# Altium project PiComputeProject.PrjPcb
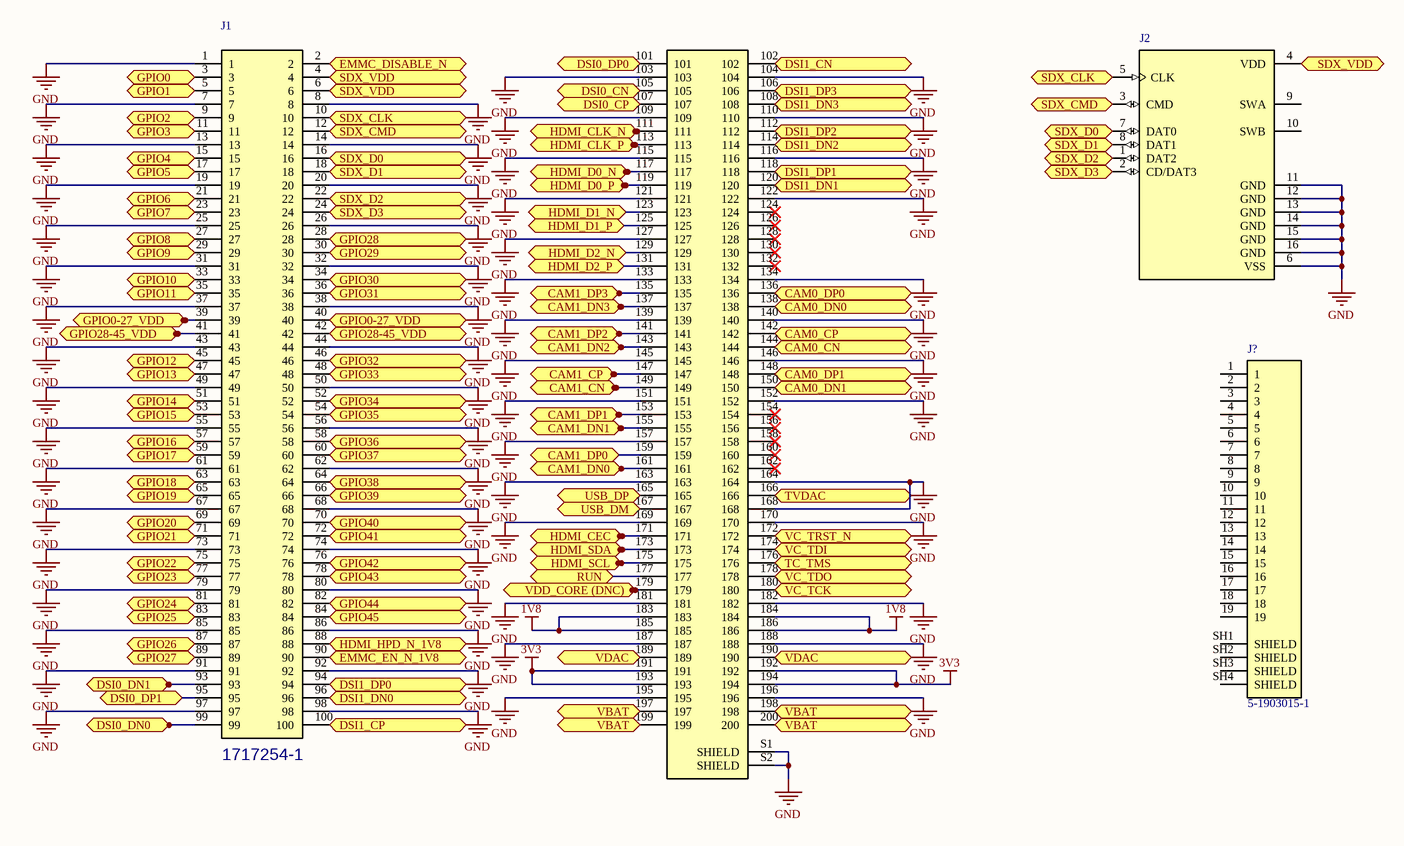
[diagram p0: Connectors.SchDoc]
3 sheets, 27 parts. Net scope: flat (ports and power ports of the same name join across sheets).
Board file: RasPiComputePCB.PcbDoc
Sheets:
  Connectors.SchDoc
  USB_HUB.SchDoc
  AUDIO.SchDoc

## Sheet Connectors.SchDoc: RasPiCompute_Connectors
size B; Engineer: Benjamin Beaudoin; Revision: v0.1

### Parts
(Parts that share a designator on the sheet are numbered #1, #2 ... from top to bottom, then left to right.)
J1  1717254-1  [TE_1717254-1_1717254-1(Primary)]
J2  2201778-1  [TE_2201778-1]  (value not drawn)
J?#1  5-1903015-1  [TE_5-1903015-1_5-1903015-1(Primary)]

### Ports
CAM0_CN, CAM0_CP, CAM0_DN0, CAM0_DN1, CAM0_DP0, CAM0_DP1, CAM1_CN, CAM1_CP, CAM1_DN0, CAM1_DN1, CAM1_DN2, CAM1_DN3, CAM1_DP0, CAM1_DP1, CAM1_DP2, CAM1_DP3, DSI0_CN, DSI0_CP, DSI0_DN0, DSI0_DN1, DSI0_DP0, DSI0_DP1, DSI1_CN, DSI1_CP, DSI1_DN0, DSI1_DN1, DSI1_DN2, DSI1_DN3, DSI1_DP0, DSI1_DP1, DSI1_DP2, DSI1_DP3, EMMC_DISABLE_N, EMMC_EN_N_1V8, GPIO0, GPIO0-27_VDD, GPIO1, GPIO2, GPIO3, GPIO4, GPIO5, GPIO6, GPIO7, GPIO8, GPIO9, GPIO10, GPIO11, GPIO12, GPIO13, GPIO14, GPIO15, GPIO16, GPIO17, GPIO18, GPIO19, GPIO20, GPIO21, GPIO22, GPIO23, GPIO24, GPIO25, GPIO26, GPIO27, GPIO28, GPIO28-45_VDD, GPIO29, GPIO30, GPIO31, GPIO32, GPIO33, GPIO34, GPIO35, GPIO36, GPIO37, GPIO38, GPIO39, GPIO40, GPIO41, GPIO42, GPIO43, GPIO44, GPIO45, HDMI_CEC, HDMI_CLK_N, HDMI_CLK_P, HDMI_D0_N, HDMI_D0_P, HDMI_D1_N, HDMI_D1_P, HDMI_D2_N, HDMI_D2_P, HDMI_HPD_N_1V8, HDMI_SCL, HDMI_SDA, RUN, SDX_CLK, SDX_CMD, SDX_D0, SDX_D1, SDX_D2, SDX_D3, SDX_VDD, TC_TMS, TVDAC, USB_DM, USB_DP, VBAT, VC_TCK, VC_TDI, VC_TDO, VC_TRST_N, VDAC, VDD_CORE (DNC)

### Nets
1V8: J1.183 J1.184 J1.185 J1.186
3V3: J1.191 J1.192 J1.193 J1.194
GND: J1.1 J1.7 J1.8 J1.13 J1.14 J1.19 J1.20 J1.25 J1.26 J1.31 J1.32 J1.37 J1.38 J1.43 J1.44 J1.49 J1.50 J1.55 J1.56 J1.61 J1.62 J1.67 J1.68 J1.73 J1.74 J1.79 J1.80 J1.85 J1.86 J1.91 J1.92 J1.97 J1.98 J1.103 J1.104 J1.109 J1.110 J1.115 J1.116 J1.121 J1.122 J1.127 J1.133 J1.134 J1.139 J1.140 J1.145 J1.146 J1.151 J1.152 J1.157 J1.163 J1.164 J1.168 J1.169 J1.170 J1.181 J1.182 J1.187 J1.188 J1.195 J1.196 J1.S1(SHIELD) J1.S2(SHIELD) J2.6(VSS) J2.11(GND) J2.12(GND) J2.13(GND) J2.14(GND) J2.15(GND) J2.16(GND)
US0_USB0_N: J1.167 ; port USB_DM
US0_USB0_P: J1.165 ; port USB_DP
NetJ1_2: J1.2 ; port EMMC_DISABLE_N
NetJ1_3: J1.3 ; port GPIO0
NetJ1_4: J1.4 J1.6 J2.4(VDD) ; port SDX_VDD
NetJ1_5: J1.5 ; port GPIO1
NetJ1_9: J1.9 ; port GPIO2
NetJ1_10: J1.10 J2.5(CLK) ; port SDX_CLK
NetJ1_11: J1.11 ; port GPIO3
NetJ1_12: J1.12 J2.3(CMD) ; port SDX_CMD
NetJ1_15: J1.15 ; port GPIO4
NetJ1_16: J1.16 J2.7(DAT0) ; port SDX_D0
NetJ1_17: J1.17 ; port GPIO5
NetJ1_18: J1.18 J2.8(DAT1) ; port SDX_D1
NetJ1_21: J1.21 ; port GPIO6
NetJ1_22: J1.22 J2.1(DAT2) ; port SDX_D2
NetJ1_23: J1.23 ; port GPIO7
NetJ1_24: J1.24 J2.2(CD/DAT3) ; port SDX_D3
NetJ1_27: J1.27 ; port GPIO8
NetJ1_28: J1.28 ; port GPIO28
NetJ1_29: J1.29 ; port GPIO9
NetJ1_30: J1.30 ; port GPIO29
NetJ1_33: J1.33 ; port GPIO10
NetJ1_34: J1.34 ; port GPIO30
NetJ1_35: J1.35 ; port GPIO11
NetJ1_36: J1.36 ; port GPIO31
NetJ1_39: J1.39 J1.40 ; port GPIO0-27_VDD
NetJ1_41: J1.41 J1.42 ; port GPIO28-45_VDD
NetJ1_45: J1.45 ; port GPIO12
NetJ1_46: J1.46 ; port GPIO32
NetJ1_47: J1.47 ; port GPIO13
NetJ1_48: J1.48 ; port GPIO33
NetJ1_51: J1.51 ; port GPIO14
NetJ1_52: J1.52 ; port GPIO34
NetJ1_53: J1.53 ; port GPIO15
NetJ1_54: J1.54 ; port GPIO35
NetJ1_57: J1.57 ; port GPIO16
NetJ1_58: J1.58 ; port GPIO36
NetJ1_59: J1.59 ; port GPIO17
NetJ1_60: J1.60 ; port GPIO37
NetJ1_63: J1.63 ; port GPIO18
NetJ1_64: J1.64 ; port GPIO38
NetJ1_65: J1.65 ; port GPIO19
NetJ1_66: J1.66 ; port GPIO39
NetJ1_69: J1.69 ; port GPIO20
NetJ1_70: J1.70 ; port GPIO40
NetJ1_71: J1.71 ; port GPIO21
NetJ1_72: J1.72 ; port GPIO41
NetJ1_75: J1.75 ; port GPIO22
NetJ1_76: J1.76 ; port GPIO42
NetJ1_77: J1.77 ; port GPIO23
NetJ1_78: J1.78 ; port GPIO43
NetJ1_81: J1.81 ; port GPIO24
NetJ1_82: J1.82 ; port GPIO44
NetJ1_83: J1.83 ; port GPIO25
NetJ1_84: J1.84 ; port GPIO45
NetJ1_87: J1.87 ; port GPIO26
NetJ1_88: J1.88 ; port HDMI_HPD_N_1V8
NetJ1_89: J1.89 ; port GPIO27
NetJ1_90: J1.90 ; port EMMC_EN_N_1V8
NetJ1_93: J1.93 ; port DSI0_DN1
NetJ1_94: J1.94 ; port DSI1_DP0
NetJ1_95: J1.95 ; port DSI0_DP1
NetJ1_96: J1.96 ; port DSI1_DN0
NetJ1_99: J1.99 ; port DSI0_DN0
NetJ1_100: J1.100 ; port DSI1_CP
NetJ1_101: J1.101 ; port DSI0_DP0
NetJ1_102: J1.102 ; port DSI1_CN
NetJ1_105: J1.105 ; port DSI0_CN
NetJ1_106: J1.106 ; port DSI1_DP3
NetJ1_107: J1.107 ; port DSI0_CP
NetJ1_108: J1.108 ; port DSI1_DN3
NetJ1_111: J1.111 ; port HDMI_CLK_N
NetJ1_112: J1.112 ; port DSI1_DP2
NetJ1_113: J1.113 ; port HDMI_CLK_P
NetJ1_114: J1.114 ; port DSI1_DN2
NetJ1_117: J1.117 ; port HDMI_D0_N
NetJ1_118: J1.118 ; port DSI1_DP1
NetJ1_119: J1.119 ; port HDMI_D0_P
NetJ1_120: J1.120 ; port DSI1_DN1
NetJ1_123: J1.123 ; port HDMI_D1_N
NetJ1_125: J1.125 ; port HDMI_D1_P
NetJ1_129: J1.129 ; port HDMI_D2_N
NetJ1_131: J1.131 ; port HDMI_D2_P
NetJ1_135: J1.135 ; port CAM1_DP3
NetJ1_136: J1.136 ; port CAM0_DP0
NetJ1_137: J1.137 ; port CAM1_DN3
NetJ1_138: J1.138 ; port CAM0_DN0
NetJ1_141: J1.141 ; port CAM1_DP2
NetJ1_142: J1.142 ; port CAM0_CP
NetJ1_143: J1.143 ; port CAM1_DN2
NetJ1_144: J1.144 ; port CAM0_CN
NetJ1_147: J1.147 ; port CAM1_CP
NetJ1_148: J1.148 ; port CAM0_DP1
NetJ1_149: J1.149 ; port CAM1_CN
NetJ1_150: J1.150 ; port CAM0_DN1
NetJ1_153: J1.153 ; port CAM1_DP1
NetJ1_155: J1.155 ; port CAM1_DN1
NetJ1_159: J1.159 ; port CAM1_DP0
NetJ1_161: J1.161 ; port CAM1_DN0
NetJ1_166: J1.166 ; port TVDAC
NetJ1_171: J1.171 ; port HDMI_CEC
NetJ1_172: J1.172 ; port VC_TRST_N
NetJ1_173: J1.173 ; port HDMI_SDA
NetJ1_174: J1.174 ; port VC_TDI
NetJ1_175: J1.175 ; port HDMI_SCL
NetJ1_176: J1.176 ; port TC_TMS
NetJ1_177: J1.177 ; port RUN
NetJ1_178: J1.178 ; port VC_TDO
NetJ1_179: J1.179 ; port VDD_CORE (DNC)
NetJ1_180: J1.180 ; port VC_TCK
NetJ1_189: J1.189 J1.190 ; port VDAC
NetJ1_197: J1.197 J1.198 J1.199 J1.200 ; port VBAT

Not connected (* = marked no-connect by the designer): J1 124* 126* 128* 130* 132* 154* 156* 158* 160* 162*; J2 9(SWA) 10(SWB); J?#1 1 2 3 4 5 6 7 8 9 10 11 12 13 14 15 16 17 18 19 SH1(SHIELD) SH2(SHIELD) SH3(SHIELD) SH4(SHIELD)

### Library data of the parts
J1 = 1717254-1: EMBOSS ASS'Y DDR SODIMM SOCKET; Centerline_Pitch: .6 mm[.024 in]; MF: TE Connectivity; Number_of_Positions: 200; Product_Type: Socket; EU_RoHS_Compliance: Compliant; Digi-Key_Part_Number: A111047CT-ND; Package: None; Digi-Key_Purchase_URL: https://www.digikey.com/product-detail/en/te-connectivity-amp-connectors/1717254-1/A111047CT-ND/4142431?utm_source=snapeda&utm_medium=aggregator&utm_campaign=symbol; SnapEDA_Link: https://www.snapeda.com/parts/1717254-1/TE%20Connectivity%20AMP%20Connectors/view-part/?ref=snap; MP: 1717254-1; Link: http://www.te.com/usa-en/product-1717254-1.html; Value: *
J2 = 2201778-1: MICRO SD PUSH PUSH LOW PROFILE TYPE; Number_of_Positions: 8; Centerline_Pitch: 1.1 mm[.04 in]; MF: TE Connectivity; Product_Type: Removable Memory Products; MP: 2201778-1; Link: http://www.te.com/usa-en/product-2201778-1.html; SnapEDA_Link: https://www.snapeda.com/parts/2201778-1/TE%20Connectivity%20AMP%20Connectors/view-part/?ref=snap; Price: 2.18 USD; EU_RoHS_Compliance: Compliant; Package: None; Availability: Good; Value: *
J?#1 = 5-1903015-1: Conn HDMI RCP 19 POS 0.5mm Solder RA SMD 19 Terminal 1 Port Embossed T/R; MF: TE Connectivity; Availability: Good; EU_RoHS_Compliance: Compliant; Price: 1.43 USD; Package: None; SnapEDA_Link: https://www.snapeda.com/parts/5-1903015-1/TE%20Connectivity%20AMP%20Connectors/view-part/?ref=snap; MP: 5-1903015-1; Link: http://www.te.com/usa-en/product-5-1903015-1.html; Value: *

## Sheet USB_HUB.SchDoc: RasPiCompute_USB_HUB
size B; Engineer: Benjamin Beaudoin; Revision: v0.1
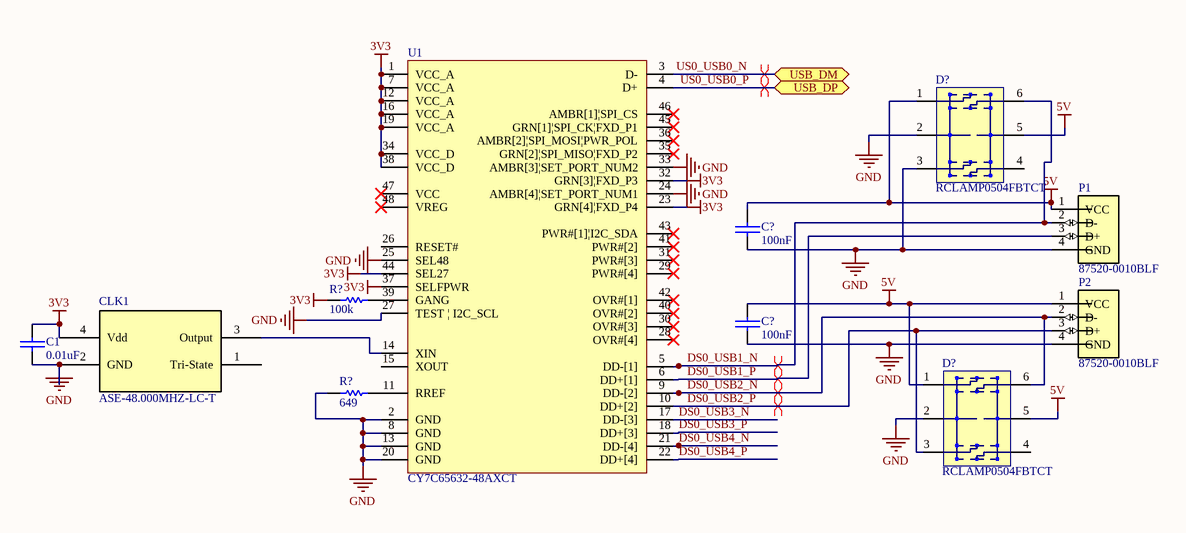
[diagram p1: USB_HUB.SchDoc]

### Parts
(Parts that share a designator on the sheet are numbered #1, #2 ... from top to bottom, then left to right.)
C1  0.01uF  [0402C]
C?#1  100nF  [0402C]
C?#2  100nF  [0402C]
CLK1  ASE-48.000MHZ-LC-T  [ASE-48.000MHZ-LC-T]
D?#1  RCLAMP0504FBTCT
D?#2  RCLAMP0504FBTCT
P1  87520-0010BLF  [FCI_87520-0010BLF]
P2  87520-0010BLF  [FCI_87520-0010BLF]
R?#1  100k  [0402C]
R?#2  649  [0402C]
U1  CY7C65632-48AXCT  [TQFP-48]

### Ports
USB_DM, USB_DP

### Nets
3V3: C1.1 CLK1.4(Vdd) R?#1.1 U1.1(VCC_A) U1.7(VCC_A) U1.12(VCC_A) U1.16(VCC_A) U1.19(VCC_A) U1.23(GRN[4]|FXD_P4) U1.32(GRN[3]|FXD_P3) U1.34(VCC_D) U1.37(SELFPWR) U1.38(VCC_D) U1.44(SEL27)
5V: C?#1.1 C?#2.1 D?#1.1 D?#1.5 D?#2.1 D?#2.5 P1.1(VCC) P2.1(VCC)
GND: C1.2 C?#1.2 C?#2.2 CLK1.2(GND) D?#1.2 D?#1.3 D?#2.2 P1.4(GND) P2.4(GND) R?#2.1 U1.2(GND) U1.8(GND) U1.13(GND) U1.20(GND) U1.24(AMBR[4]|SET_PORT_NUM1) U1.25(SEL48) U1.27(TEST_|_I2C_SCL) U1.33(AMBR[3]|SET_PORT_NUM2)
DS0_USB1_N: D?#1.6 P1.2(D-) U1.5(DD-[1])
DS0_USB1_P: P1.3(D+) U1.6(DD+[1])
DS0_USB2_N: D?#2.6 P2.2(D-) U1.9(DD-[2])
DS0_USB2_P: D?#2.3 P2.3(D+) U1.10(DD+[2])
DS0_USB3_N: U1.17(DD-[3])
DS0_USB3_P: U1.18(DD+[3])
DS0_USB4_N: U1.21(DD-[4])
DS0_USB4_P: U1.22(DD+[4])
US0_USB0_N: U1.3(D-) ; port USB_DM
US0_USB0_P: U1.4(D+) ; port USB_DP
NetCLK1_3: CLK1.3(Output) U1.14(XIN)
NetR?#1_2: R?#1.2 U1.39(GANG)
NetR?#2_2: R?#2.2 U1.11(RREF)

Not connected (* = marked no-connect by the designer): CLK1 1(Tri-State); D?#1 4(0); D?#2 4(0); U1 15(XOUT) 26(RESET#) 28(OVR#[4])* 29(PWR#[4])* 30(OVR#[3])* 31(PWR#[3])* 35(GRN[2]|SPI_MISO|FXD_P2)* 36(AMBR[2]|SPI_MOSI|PWR_POL)* 40(OVR#[2])* 41(PWR#[2])* 42(OVR#[1])* 43(PWR#[1]|I2C_SDA)* 45(GRN[1]|SPI_CK|FXD_P1)* 46(AMBR[1]|SPI_CS)* 47(VCC)* 48(VREG)*

### Layout directives
differential pair: DS0_USB1_N, DS0_USB1_P, DS0_USB2_N, DS0_USB2_P, US0_USB0_N, US0_USB0_P

### Library data of the parts
C1 C?#1 C?#2 = C: Capacitor; Power_WV_SRF: 25V; MFGPN: *; MFG: *; Tolerance: *; TempCo: *; Distributor: *; CMPN: *
  C1: Value: 0.01uF
  C?#1 C?#2: Value: 100nF
CLK1 = ASE-48.000MHZ-LC-T: OSC XO 48.000MHZ CMOS SMD
D?#1 D?#2 = RCLAMP0504FBTCT: TVS DIODE 5V 17.5V SC70-6
P1 P2 = 87520-0010BLF: 87520 Series Single Port 4 Contact Unshielded Board Lock USB-A Receptacle; MF: Amphenol ICC; Digi-Key_Purchase_URL: https://www.digikey.com/product-detail/en/amphenol-fci/87520-0010BLF/609-1045-ND/1001359?utm_source=snapeda&utm_medium=aggregator&utm_campaign=symbol; Digi-Key_Part_Number: 609-1045-ND; Package: None; SnapEDA_Link: https://www.snapeda.com/parts/87520-0010BLF/Amphenol%20ICC/view-part/?ref=snap; MP: 87520-0010BLF; Value: *
R?#1 = R: Resistor; Tolerance: 5%; Value: 100k; Power_WV_SRF: *; MFG: *; MFGPN: *; Distributor: *; CMPN: *
R?#2 = R: Resistor; Tolerance: 1%; Value: 649; Power_WV_SRF: *; MFG: *; MFGPN: *; Distributor: *; CMPN: *

## Sheet AUDIO.SchDoc: RasPiCompute_AUDIO
size B; Engineer: Benjamin Beaudoin; Revision: v0.1
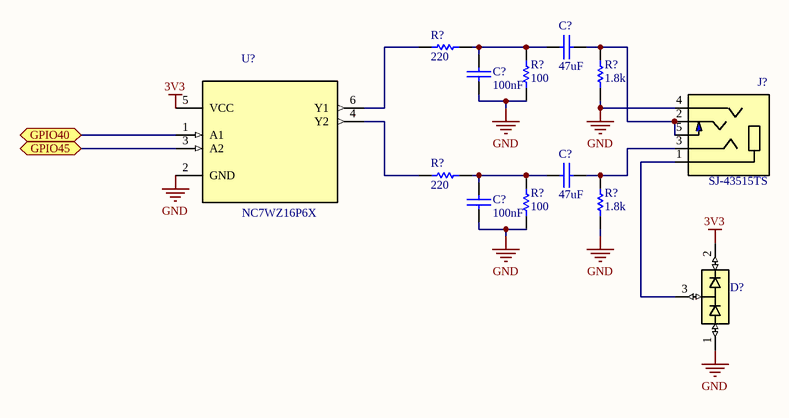
[diagram p2: AUDIO.SchDoc]

### Parts
(Parts that share a designator on the sheet are numbered #1, #2 ... from top to bottom, then left to right.)
C?#3  47uF  [0402C]
C?#4  100nF  [0402C]
C?#5  47uF  [0402C]
C?#6  100nF  [0402C]
D?#3  BAV99  [SOT23-3]  (value not drawn)
J?#2  SJ-43515TS  [CUI_SJ-43515TS]
R?#3  220  [0402C]
R?#4  100  [0402C]
R?#5  1.8k  [0402C]
R?#6  220  [0402C]
R?#7  100  [0402C]
R?#8  1.8k  [0402C]
U?  NC7WZ16P6X  [SOT65P210X110-6N]

### Ports
GPIO40, GPIO45

### Nets
3V3: D?#3.2(C2) U?.5(VCC)
GND: C?#4.1 C?#6.1 D?#3.1(A1) J?#2.4(RING2) R?#4.1 R?#5.1 R?#7.1 R?#8.1 U?.2(GND)
NetC?#3_1: C?#3.1 C?#4.2 R?#3.2 R?#4.2
NetC?#3_2: C?#3.2 J?#2.2(TIP) J?#2.5(TIP_SWITCH) R?#5.2
NetC?#5_1: C?#5.1 C?#6.2 R?#6.2 R?#7.2
NetC?#5_2: C?#5.2 J?#2.3(RING1) R?#8.2
NetD?#3_3: D?#3.3(COM) J?#2.1(SLEEVE)
NetJ1_70: U?.1(A1) ; port GPIO40
NetJ1_84: U?.3(A2) ; port GPIO45
NetR?#3_1: R?#3.1 U?.6(Y1)
NetR?#6_1: R?#6.1 U?.4(Y2)

### Library data of the parts
C?#3-C?#6 = C: Capacitor; Power_WV_SRF: 25V; MFGPN: *; MFG: *; Tolerance: *; TempCo: *; Distributor: *; CMPN: *
  C?#3 C?#5: Value: 47uF
  C?#4 C?#6: Value: 100nF
D?#3 = BAV99: Diode, Small Signal; 250 mA; 1.25 V _Max._; 300 mW; 430 K/W; 70 V; 6 nS _Max._; MF: ON Semiconductor; SnapEDA_Link: https://www.snapeda.com/parts/BAV99/ON%20Semiconductor/view-part/?ref=snap; Package: SOT-23-3 Vishay; Price: 0.07 USD; Availability: Unavailable; MP: BAV99; Value: *
J?#2 = SJ-43515TS: 4 Conductor PCB Mount Low Profile 3.5 mm Audio Jack; MF: CUI; MP: SJ-43515TS; Package: None; Availability: Good; SnapEDA_Link: https://www.snapeda.com/parts/SJ-43515TS/CUI/view-part/?ref=snap; Price: 0.73 USD; Value: *
R?#3-R?#8 = R: Resistor; Tolerance: 5%; Power_WV_SRF: *; MFG: *; MFGPN: *; Distributor: *; CMPN: *
  R?#3 R?#6: Value: 220
  R?#4 R?#7: Value: 100
  R?#5 R?#8: Value: 1.8k
U? = NC7WZ16P6X: NC7WZ16 Series 5.5 V Surface Mount TinyLogic UHS Dual Buffer - SC-70-6; MF: ON Semiconductor; MP: NC7WZ16P6X; SnapEDA_Link: https://www.snapeda.com/parts/NC7WZ16P6X/ON%20Semiconductor/view-part/?ref=snap; Price: 0.13 USD; Availability: Good; Package: SC-70-6 ON Semiconductor; Value: *

## Nets that join several sheets
3V3: Connectors (J1.191 J1.192 J1.193 J1.194), USB_HUB (14 pins), AUDIO (D?#3.2 U?.5)
GND: Connectors (71 pins), USB_HUB (18 pins), AUDIO (9 pins)
NetJ1_70: Connectors (J1.70), AUDIO (U?.1)
NetJ1_84: Connectors (J1.84), AUDIO (U?.3)
US0_USB0_N: Connectors (J1.167), USB_HUB (U1.3)
US0_USB0_P: Connectors (J1.165), USB_HUB (U1.4)